# EAGLE schematic bracelet go-safe (EAGLE 7.5.0)
Schéma électrique
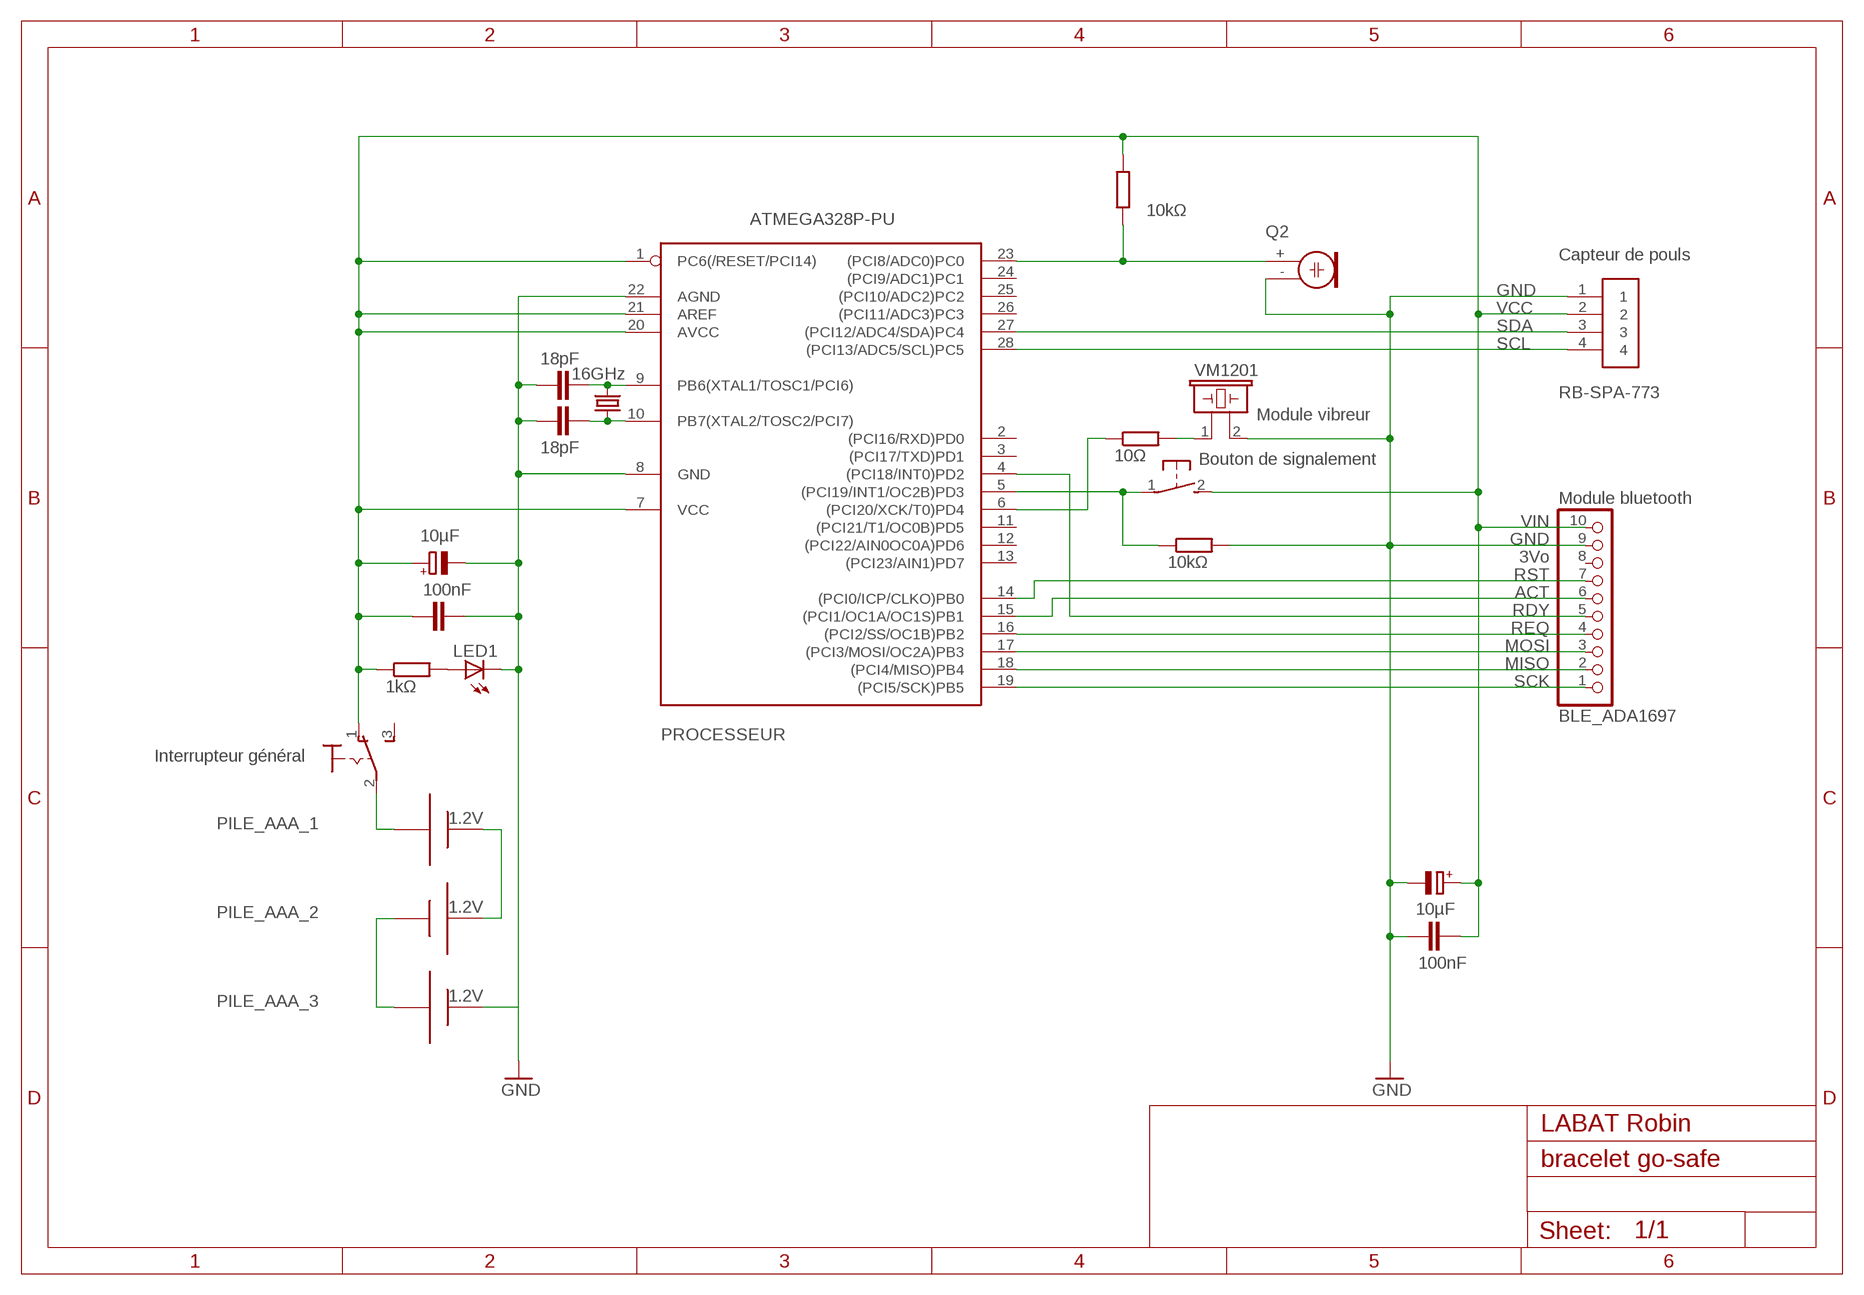
[diagram p0: schematic, sheet 1]

## Parts
BLE_ADA1697  Module bluetooth  PINHD-1X10  [1X10-BIG]
C1  18pF  C-EU025-024X044  [C025-024X044]
C2  18pF  C-EU025-024X044  [C025-024X044]
C3  100nF  C-EU025-024X044  [C025-024X044]
C4  100nF  C-EU025-024X044  [C025-024X044]
C5  10µF  CPOL-EU085CS-1AR  [085CS_1AR]
C6  10µF  CPOL-EU085CS-1AR  [085CS_1AR]
FRAME1  A4L-LOC  [A4L-LOC]
LED1  LED  [SMARTLED-TTW]
PILE_AAA_1  AAA  [12BH412]
PILE_AAA_2  AAA  [12BH412]
PILE_AAA_3  AAA  [12BH412]
PROCESSEUR  ATMEGA328P-PU  ATMEGA168V-10P  [DIL28-3]
Q1  16GHz  CRYSTAL68SMX  [86SMX]
Q2  ELECTRET  [9.7ELECTRET]
R1  10Ω  R-EU_0204/2V  [0204V]
R2  10kΩ  R-EU_0204/2V  [0204V]
R3  1kΩ  R-EU_0204/2V  [0204V]
R4  10kΩ  R-EU_0204/2V  [0204V]
RB-SPA-773  Capteur de pouls  1X4-3.5MM  [1X04-3.5MM]
S2  Bouton de signalement  31-XX  [B3F-31XX]
S3  Interrupteur général  320-916  [320-916]
VM1201  Module vibreur  B/C14S  [B/C14S]

## Nets
GND: BLE_ADA1697.9 C1.1 C2.1 C3.2 C4.2 C5.- C6.- LED1.C@1(C) PILE_AAA_3.+ PROCESSEUR.8(GND) PROCESSEUR.22(AGND) Q2.- R2.2 RB-SPA-773.1 VM1201.2
N$1: PILE_AAA_2.+ PILE_AAA_3.-
N$2: PILE_AAA_1.+ PILE_AAA_2.-
N$3: BLE_ADA1697.10 C3.1 C4.1 C5.+ C6.+ PROCESSEUR.1(PC6(/RESET/PCI14)) PROCESSEUR.7(VCC) PROCESSEUR.20(AVCC) PROCESSEUR.21(AREF) R3.1 R4.2 RB-SPA-773.2 S2.2(S) S3.1(O)
N$4: C2.2 PROCESSEUR.10(PB7(XTAL2/TOSC2/PCI7)) Q1.1
N$5: C1.2 PROCESSEUR.9(PB6(XTAL1/TOSC1/PCI6)) Q1.4
N$6: BLE_ADA1697.1 PROCESSEUR.19((PCI5/SCK)PB5)
N$7: PILE_AAA_1.- S3.2(P)
N$8: BLE_ADA1697.2 PROCESSEUR.18((PCI4/MISO)PB4)
N$9: BLE_ADA1697.3 PROCESSEUR.17((PCI3/MOSI/OC2A)PB3)
N$10: BLE_ADA1697.4 PROCESSEUR.16((PCI2/SS/OC1B)PB2)
N$11: BLE_ADA1697.5 PROCESSEUR.4((PCI18/INT0)PD2)
N$12: BLE_ADA1697.7 PROCESSEUR.14((PCI0/ICP/CLKO)PB0)
N$13: BLE_ADA1697.6 PROCESSEUR.15((PCI1/OC1A/OC1S)PB1)
N$14: PROCESSEUR.27((PCI12/ADC4/SDA)PC4) RB-SPA-773.3
N$15: R1.2 VM1201.1
N$17: PROCESSEUR.6((PCI20/XCK/T0)PD4) R1.1
N$18: PROCESSEUR.28((PCI13/ADC5/SCL)PC5) RB-SPA-773.4
N$19: LED1.A@1(A) R3.2
N$20: PROCESSEUR.5((PCI19/INT1/OC2B)PD3) R2.1 S2.1(P)
N$21: PROCESSEUR.23((PCI8/ADC0)PC0) Q2.+ R4.1
Unconnected: BLE_ADA1697.8 PROCESSEUR.2((PCI16/RXD)PD0) PROCESSEUR.3((PCI17/TXD)PD1) PROCESSEUR.11((PCI21/T1/OC0B)PD5) PROCESSEUR.12((PCI22/AIN0OC0A)PD6) PROCESSEUR.13((PCI23/AIN1)PD7) PROCESSEUR.24((PCI9/ADC1)PC1) PROCESSEUR.25((PCI10/ADC2)PC2) PROCESSEUR.26((PCI11/ADC3)PC3) S3.3(S)

## Library data of the parts
BLE_ADA1697 = adafruit:PINHD-1X10: Pin header 1x10 0.1" spacing With round pins; PIN1: SCK; PIN10: VIN; PIN2: MISO; PIN3: MOSI; PIN4: REQ; PIN5: RDY; PIN6: ACT; PIN7: RST; PIN8: 3Vo; PIN9: GND
C1-C4 = rcl:C-EU: CAPACITOR, European symbol
C5 C6 = rcl:CPOL-EU: POLARIZED CAPACITOR, European symbol
FRAME1 = frames:A4L-LOC: FRAME DIN A4, landscape with location and doc. field
LED1 = adafruit:LED: LED OSRAM: - CHIPLED LG R971, LG N971, LY N971, LG Q971, LY Q971, LO R971, LY R971 LH N974, LH R974 LS Q976, LO Q976, LY Q976 LO Q996 - Hyper CHIPLED LW Q18S LB Q993, LB Q99A, LB R99A - SideLED LS A670, LO A670, LY A670, LG A670, LP A670 LB A673, LV A673, LT A673, LW A673 LH A674 LY A675 LS A676, LA A676, LO A676, LY A676, LW A676 LS A679, LY A679, LG A679 - Hyper Micro SIDELED® LS Y876, LA Y876, LO Y876, LY Y876 LT Y87S - SmartLED LW L88C, LW L88S LB L89C, LB L89S, LG L890 LS L89K, LO L89K, LY L89K LS L896, LA L896, LO L896, LY L896 - TOPLED LS T670, LO T670, LY T670, LG T670, LP T670 LSG T670, LSP T670, LSY T670, LOP T670, LYG T670 LG T671, LOG T671, LSG T671 LB T673, LV T673, LT T673, LW T673 LH T674 LS T676, LA T676, LO T676, LY T676, LB T676, LH T676, LSB T676, LW T676 LB T67C, LV T67C, LT T67C, LS T67K, LO T67K, LY T67K, LW E67C LS E67B, LA E67B, LO E67B, LY E67B, LB E67C, LV E67C, LT E67C LW T67C LS T679, LY T679, LG T679 LS T770, LO T770, LY T770, LG T770, LP T770 LB T773, LV T773, LT T773, LW T773 LH T774 LS E675, LA E675, LY E675, LS T675 LS T776, LA T776, LO T776, LY T776, LB T776 LHGB T686 LT T68C, LB T68C - Hyper Mini TOPLED® LB M676 - Mini TOPLED Santana® LG M470 LS M47K, LO M47K, LY M47K Source: http://www.osram.convergy.de/
PILE_AAA_1-PILE_AAA_3 = adafruit:AAA: AAA PC pin holder Mouser part #12BH412 - but pretty much any 1x AAA battery holder should be the same http://www.ladyada.net/library/pcb/eaglelibrary.html; TENSION: 1.2V
PROCESSEUR = adafruit:ATMEGA168*P: MICROCONTROLLER 16 kBytes FLASH 1 kBytes SRAM 512 Bytes EEPROM USART 8-channel 10 bit ADC
Q1 = adafruit:CRYSTAL: CRYSTAL; OC_FARNELL: 6344860; OC_NEWARK: unknown
Q2 = adafruit:ELECTRET: Electret microphone Thru hole 2.54mm spacing with 9.7mm diameter
R1-R4 = rcl:R-EU_: RESISTOR, European symbol
RB-SPA-773 = adafruit:1X4: 4-pin connector; PIN1: GND; PIN2: VCC; PIN3: SDA; PIN4: SCL
S2 = switch-omron:31-XX: OMRON SWITCH; MPN: B3F-3100; OC_FARNELL: 959704; OC_NEWARK: 36M3582
S3 = switch:320-916: TOGGLE SWITCH distributor RS Components
VM1201 = buzzer:B/C14S: BUZZER Source: Buerklin; OC_FARNELL: unknown; OC_NEWARK: unknown